# EAGLE schematic u prog with esp12 (EAGLE 9.6.1)
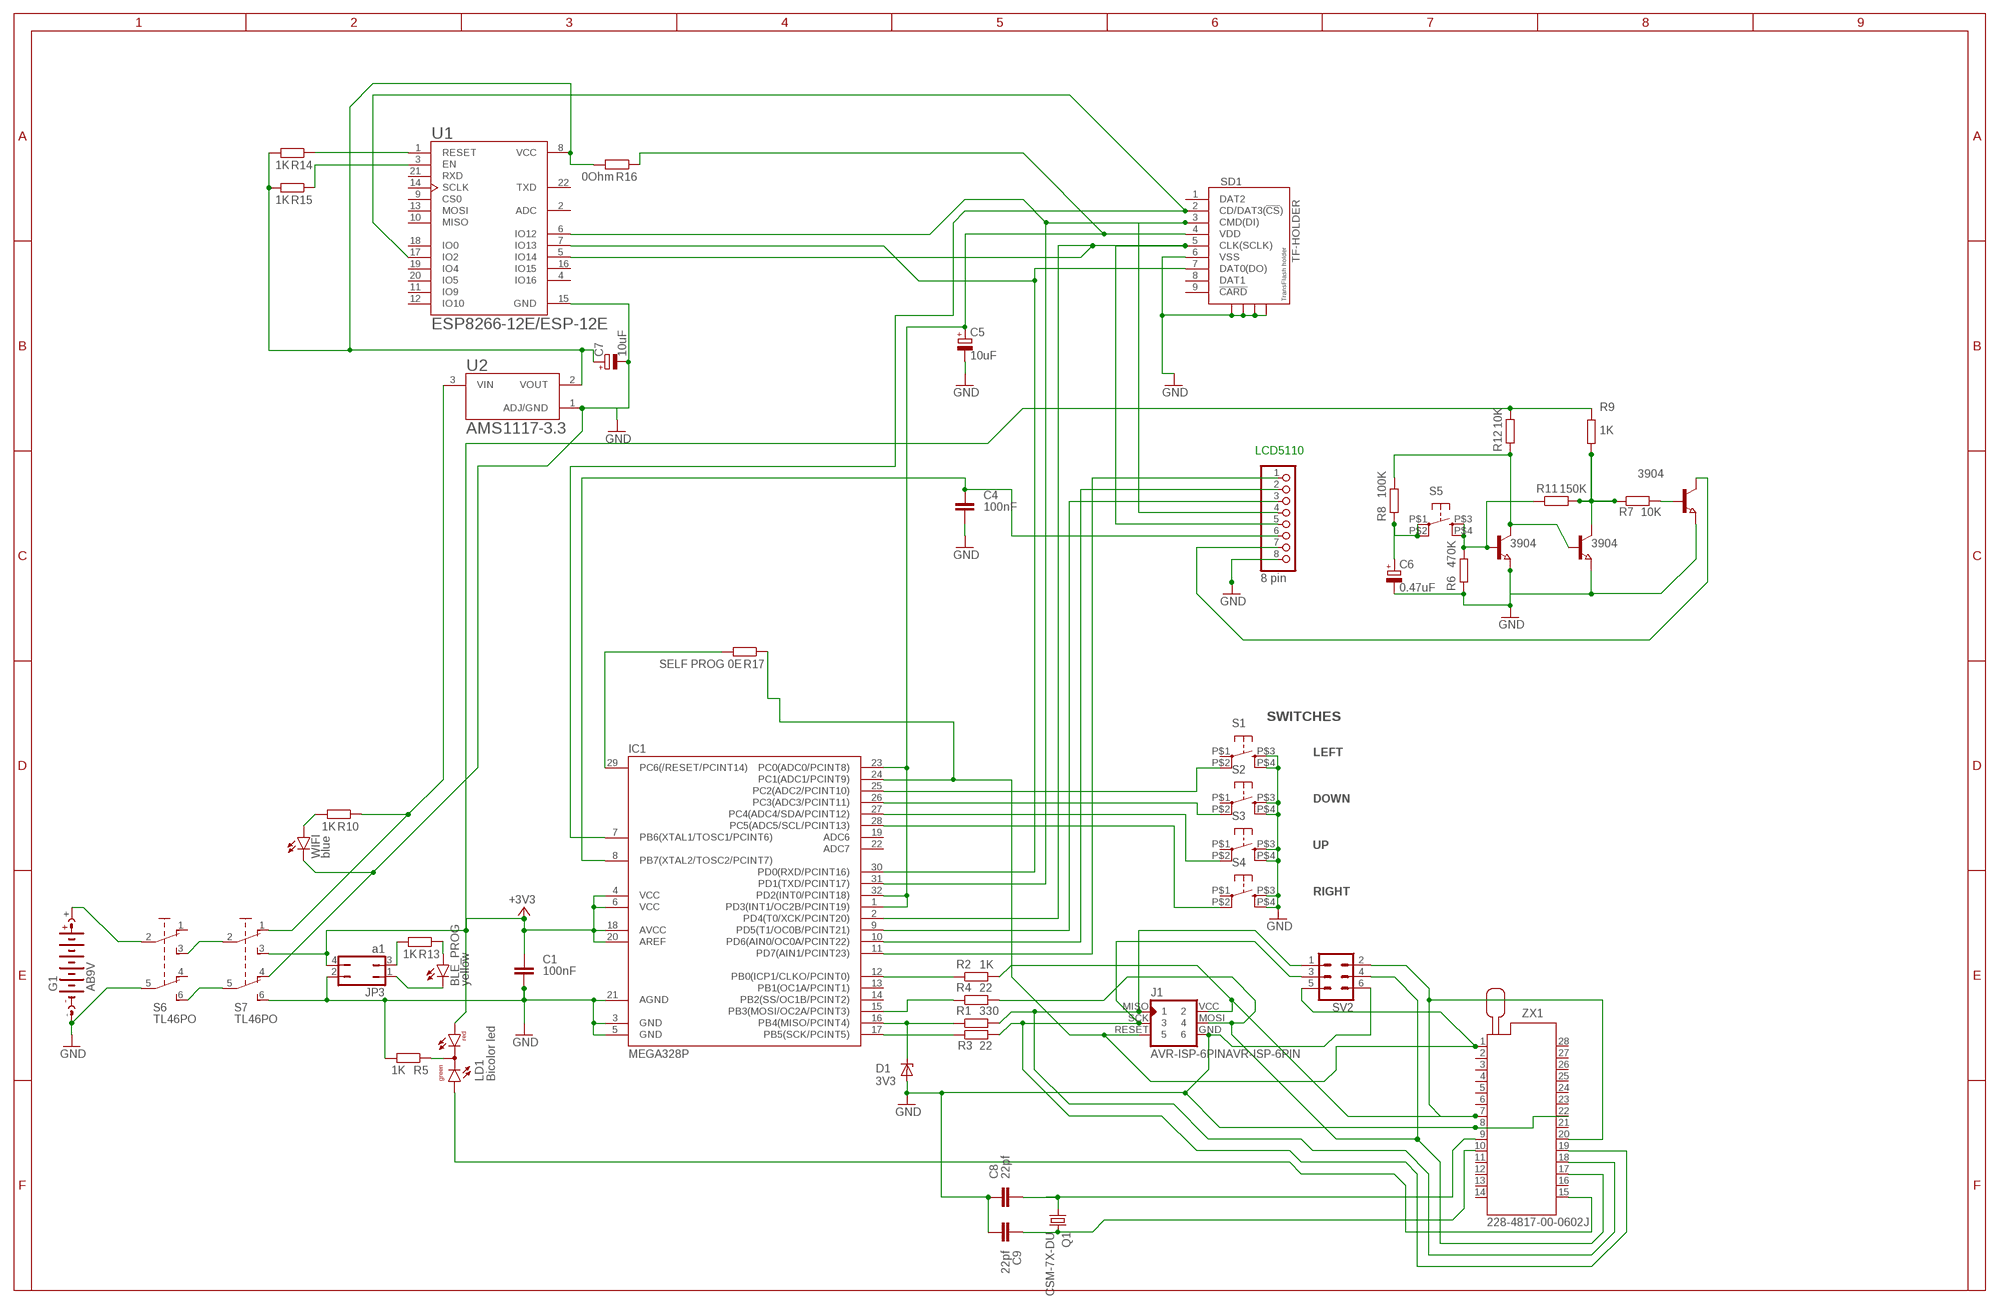
[diagram p0: schematic, sheet 1]

## Parts
BLE_PROG  yellow  LED5MM  [LED5MM]
C1  100nF  C-EUC0805  [C0805]
C4  100nF  C-EUC0805  [C0805]
C5  10uF  CPOL-EUC/6032-28R  [C/6032-28R]
C6  0.47uF  CPOL-EUC/6032-28R  [C/6032-28R]
C7  10uF  CPOL-EUC/6032-28R  [C/6032-28R]
C8  22pf  C-EUC0805  [C0805]
C9  22pf  C-EUC0805  [C0805]
D1  3V3  ZENER-DIODESOD80C  [SOD80C]
G1  AB9V  [AB9V]
IC1  MEGA328P  MEGA48/88/168-AU  [TQFP32-08]
J1  AVR-ISP-6PINAVR-ISP-6PIN  [AVR-ISP-6PIN]
JP1  8 pin  PINHD-1X8  [1X08]
JP3  a1  JP2Q  [JP2Q]
LD1  Bicolor led  DUOLED-RG-C  [DUOLED-C-5MM]
Q1  CSM-7X-DU  [CSM-7X-DU]
Q2  3904  NPN-TRANSISTOR_SOT23  [SOT23]
Q3  3904  NPN-TRANSISTOR_SOT23  [SOT23]
Q4  3904  NPN-TRANSISTOR_SOT23  [SOT23]
R1  330  R-EU_R0805  [R0805]
R2  1K  R-EU_R0805  [R0805]
R3  22  R-EU_R0805  [R0805]
R4  22  R-EU_R0805  [R0805]
R5  1K  R-EU_R0805  [R0805]
R6  470K  R-EU_R0805  [R0805]
R7  10K  R-EU_R0805  [R0805]
R8  100K  R-EU_R0805  [R0805]
R9  1K  R-EU_R0805  [R0805]
R10  1K  R-EU_R0805  [R0805]
R11  150K  R-EU_R0805  [R0805]
R12  10K  R-EU_R0805  [R0805]
R13  1K  R-EU_R0805  [R0805]
R14  1K  R-EU_R0805  [R0805]
R15  1K  R-EU_R0805  [R0805]
R16  0Ohm  R-EU_R0805  [R0805]
R17  SELF PROG 0E  R-EU_R0805  [R0805]
S1  10-XX-SMD  [B3F-10XX-SMD]
S2  10-XX-SMD  [B3F-10XX-SMD]
S3  10-XX-SMD  [B3F-10XX-SMD]
S4  10-XX-SMD  [B3F-10XX-SMD]
S5  10-XX-SMD  [B3F-10XX-SMD]
S6  TL46PO  [TL4XPO]
S7  TL46PO  [TL4XPO]
SD1  TF-HOLDER  [TF-PULL]
SV2  MA03-2  [MA03-2]
U1  ESP8266-12E/ESP-12E  [XCVR_ESP8266-12E/ESP-12E]
U2  AMS1117-3.3  [SOT229P700X180-4N]
WIFI  blue  LED5MM  [LED5MM]
ZX1  228-4817-00-0602J  [228-4817-00-0602J]

## Nets
+3V3: C1.1 IC1.4(VCC) IC1.6(VCC) IC1.18(AVCC) IC1.20(AREF) JP3.4 LD1.AR R9.1 R12.2 S7.3(S)
GND: C1.2 C4.2 C5.- C6.- C7.- C8.1 C9.2 D1.A G1.- IC1.3(GND) IC1.5(GND) IC1.21(AGND) J1.GND JP1.8 JP3.2 Q2.2(E) Q3.2(E) Q4.2(E) R5.2 R6.1 S1.P$3(S) S1.P$4(S1) S2.P$3(S) S2.P$4(S1) S3.P$3(S) S3.P$4(S1) S4.P$3(S) S4.P$4(S1) S6.5(P1) S7.4(O1) S7.6(S1) SD1.6(VSS) SD1.S1 SD1.S2 SD1.S3 SD1.S4 SV2.6 U1.15(GND) U2.1(ADJ/GND) WIFI.K(C) ZX1.8 ZX1.22
LCD-VCC: C4.1 IC1.8(PB7(XTAL2/TOSC2/PCINT7)) JP1.6
MOSI: IC1.15(PB3(MOSI/OC2A/PCINT3)) R4.1
N$1: IC1.17(PB5(SCK/PCINT5)) R3.1
N$2: IC1.12(PB0(ICP1/CLKO/PCINT0)) R2.1
N$3: D1.C IC1.16(PB4(MISO/PCINT4)) R1.1
N$4: IC1.9(PD5(T1/OC0B/PCINT21)) JP1.3
N$5: J1.MISO R1.2 SV2.1 ZX1.18
N$6: J1.SCK R3.2 SV2.3 ZX1.19
N$7: LD1.C R5.1
N$8: G1.+ S6.2(P)
N$9: IC1.30(PD0(RXD/PCINT16)) SD1.7(DAT0(DO)) U1.7(IO13)
N$10: C8.2 Q1.1 ZX1.9
N$11: IC1.11(PD7(AIN1/PCINT23)) JP1.1
N$12: IC1.10(PD6(AIN0/OC0A/PCINT22)) JP1.2
N$13: IC1.31(PD1(TXD/PCINT17)) JP1.4 SD1.3(CMD(DI)) U1.6(IO12)
N$14: C9.1 Q1.2 ZX1.10
N$15: Q2.3(C) Q3.1(B) R8.2 R12.1
N$16: Q3.3(C) R7.1 R9.2 R11.2
N$17: IC1.29(PC6(/RESET/PCINT14)) R17.2
N$18: J1.VCC R2.2 SV2.2 ZX1.7 ZX1.20
N$19: Q2.1(B) R6.2 R11.1 S5.P$3(S) S5.P$4(S1)
N$21: J1.MOSI R4.2 SV2.4 ZX1.17
N$22: IC1.28(PC5(ADC5/SCL/PCINT13)) S4.P$2(P1)
N$23: IC1.27(PC4(ADC4/SDA/PCINT12)) S3.P$2(P1)
N$24: IC1.26(PC3(ADC3/PCINT11)) S2.P$2(P1)
N$25: IC1.25(PC2(ADC2/PCINT10)) S1.P$2(P1)
N$26: LD1.AX(AG) ZX1.15
N$27: C6.+ R8.1 S5.P$1(P) S5.P$2(P1)
N$28: Q4.1(B) R7.2
N$30: JP1.7 Q4.3(C)
N$31: IC1.7(PB6(XTAL1/TOSC1/PCINT6)) SD1.2(CD/DAT3(!CS!)) U1.17(IO2)
N$32: BLE_PROG.A R13.1
N$33: S6.6(S1) S7.5(P1)
N$34: S6.3(S) S7.2(P)
N$35: R10.2 WIFI.A
N$36: R10.1 S7.1(O) U2.3(VIN)
N$37: BLE_PROG.K(C) JP3.1
N$38: JP3.3 R13.2
N$39: R14.1 U1.1(RESET)
N$40: R15.1 U1.3(EN)
N$41: C7.+ R14.2 R15.2 R16.2 U1.8(VCC) U2.2(VOUT)
RST: IC1.24(PC1(ADC1/PCINT9)) J1.RESET R17.1 SV2.5 ZX1.1
SCK2: IC1.2(PD4(T0/XCK/PCINT20)) JP1.5 SD1.5(CLK(SCLK)) U1.5(IO14)
SD-VCC: C5.+ IC1.1(PD3(INT1/OC2B/PCINT19)) IC1.23(PC0(ADC0/PCINT8)) IC1.32(PD2(INT0/PCINT18)) R16.1 SD1.4(VDD)
Unconnected: IC1.13(PB1(OC1A/PCINT1)) IC1.14(PB2(SS/OC1B/PCINT2)) IC1.19(ADC6) IC1.22(ADC7) S1.P$1(P) S2.P$1(P) S3.P$1(P) S4.P$1(P) S6.1(O) S6.4(O1) SD1.1(DAT2) SD1.8(DAT1) SD1.9(!CARD) U1.2(ADC) U1.4(IO16) U1.9(CS0) U1.10(MISO) U1.11(IO9) U1.12(IO10) U1.13(MOSI) U1.14(SCLK) U1.16(IO15) U1.18(IO0) U1.19(IO4) U1.20(IO5) U1.21(RXD) U1.22(TXD) ZX1.2 ZX1.3 ZX1.4 ZX1.5 ZX1.6 ZX1.11 ZX1.12 ZX1.13 ZX1.14 ZX1.16 ZX1.21 ZX1.23 ZX1.24 ZX1.25 ZX1.26 ZX1.27 ZX1.28

## Notes on the sheet
- LCD5110
- SWITCHES
- LEFT
- DOWN
- UP
- RIGHT

## Library data of the parts
BLE_PROG WIFI = led:LED: LED OSRAM: - CHIPLED LG R971, LG N971, LY N971, LG Q971, LY Q971, LO R971, LY R971 LH N974, LH R974 LS Q976, LO Q976, LY Q976 LO Q996 - Hyper CHIPLED LW Q18S LB Q993, LB Q99A, LB R99A - SideLED LS A670, LO A670, LY A670, LG A670, LP A670 LB A673, LV A673, LT A673, LW A673 LH A674 LY A675 LS A676, LA A676, LO A676, LY A676, LW A676 LS A679, LY A679, LG A679 - Hyper Micro SIDELED® LS Y876, LA Y876, LO Y876, LY Y876 LT Y87S - SmartLED LW L88C, LW L88S LB L89C, LB L89S, LG L890 LS L89K, LO L89K, LY L89K LS L896, LA L896, LO L896, LY L896 - TOPLED LS T670, LO T670, LY T670, LG T670, LP T670 LSG T670, LSP T670, LSY T670, LOP T670, LYG T670 LG T671, LOG T671, LSG T671 LB T673, LV T673, LT T673, LW T673 LH T674 LS T676, LA T676, LO T676, LY T676, LB T676, LH T676, LSB T676, LW T676 LB T67C, LV T67C, LT T67C, LS T67K, LO T67K, LY T67K, LW E67C LS E67B, LA E67B, LO E67B, LY E67B, LB E67C, LV E67C, LT E67C LW T67C LS T679, LY T679, LG T679 LS T770, LO T770, LY T770, LG T770, LP T770 LB T773, LV T773, LT T773, LW T773 LH T774 LS E675, LA E675, LY E675, LS T675 LS T776, LA T776, LO T776, LY T776, LB T776 LHGB T686 LT T68C, LB T68C - Hyper Mini TOPLED® LB M676 - Mini TOPLED Santana® LG M470 LS M47K, LO M47K, LY M47K Source: http://www.osram.convergy.de LUXEON: - LUMILED® LXK2-PW12-R00, LXK2-PW12-S00, LXK2-PW14-U00, LXK2-PW14-V00 LXK2-PM12-R00, LXK2-PM12-S00, LXK2-PM14-U00 LXK2-PE12-Q00, LXK2-PE12-R00, LXK2-PE12-S00, LXK2-PE14-T00, LXK2-PE14-U00 LXK2-PB12-K00, LXK2-PB12-L00, LXK2-PB12-M00, LXK2-PB14-N00, LXK2-PB14-P00, LXK2-PB14-Q00 LXK2-PR12-L00, LXK2-PR12-M00, LXK2-PR14-Q00, LXK2-PR14-R00 LXK2-PD12-Q00, LXK2-PD12-R00, LXK2-PD12-S00 LXK2-PH12-R00, LXK2-PH12-S00 LXK2-PL12-P00, LXK2-PL12-Q00, LXK2-PL12-R00 Source: www.luxeon.com KINGBRIGHT: KA-3528ASYC Source: www.kingbright.com
C1 C4 C8 C9 = rcl:C-EU: CAPACITOR, European symbol
C5-C7 = rcl:CPOL-EU: POLARIZED CAPACITOR, European symbol
D1 = diode:ZENER-DIODE: Z-Diode
G1 = battery:AB9V: 9-V BATTERY CLIP
IC1 = avr-6:MEGA48/88/168
J1 = avr-isp:AVR-ISP-6PIN: AVR ISP 6pin 3x2 pin header
JP1 = pinhead:PINHD-1X8: PIN HEADER
JP3 = jumper:JP2Q: JUMPER
LD1 = led:DUOLED-RG-C: DUO LED 2 colors (red/green), 5 mm, round, common Cathode www.ligitek.com or other producers.
Q1 = crystal:CSM-7X-DU: SMD CRYSTAL Source: www.ecsxtal.com .. Crystal 3.6864MHz CSM_7X_DU.PDF; OC_FARNELL: unknown; OC_NEWARK: unknown
Q2-Q4 = semicon-smd-ipc:NPN-TRANSISTOR_: NPN TRANSISTOR
R1-R17 = rcl:R-EU_: RESISTOR, European symbol; SPICEPREFIX: R
S1-S5 = switch-omron:10-XX-SMD
S6 S7 = switch:TL46PO: TINY SWITCH ON - ON Source: http://www2.produktinfo.conrad.com/datenblaetter/700000-724999/705152-da-01-de-Subminiaturschalter_TL_36YO.pdf
SD1 = sd-mmc:TF-HOLDER: TF / Micro SD socket is PUSH-PUSH type, the card can be pushed into and auto locked and pushed out by simply press the card. Surface Mounting type.
SV2 = con-lstb:MA03-2: PIN HEADER; OC_FARNELL: unknown; OC_NEWARK: unknown
U1 = ESP8266-12E_ESP-12E:ESP8266-12E/ESP-12E: ESP-12E WiFi Module Check availability <https://pricing.snapeda.com/parts/ESP8266-12E/ESP-12E/AI-Thinker/view-part?ref=eda>; AVAILABILITY: Not in stock; DESCRIPTION: This WiFi module has a 32-bit MCU micro and clock speeds supporting 80 MHz or 160 MHz. Supports the RTOS and integrated Wi-Fi MAC/BB/RF/PA/LNA, and has an on-board antenna.; MF: AI-Thinker; MP: ESP8266-12E/ESP-12E; PACKAGE: None; PRICE: None
U2 = AMS1117-3.3:AMS1117-3.3: Sot223/Pkg 1-Amp 3.3-Volt Low Drop Out Voltage Regulatator Check availability <https://pricing.snapeda.com/parts/AMS1117-3.3/Advanced%20Monolithic%20Systems/view-part?ref=eda>; AVAILABILITY: In Stock; DESCRIPTION: Sot223/Pkg 1-Amp 3.3-Volt Low Drop Out Voltage Regulatator; MF: Advanced Monolithic Systems; MP: AMS1117-3.3; PACKAGE: SOT-223 Seeed Technology; PRICE: None
ZX1 = con-3m:228-?00-0602J: Zero Insertion Force Socked Source: http://www.3M.com/ehpd; MF: 3M; MPN: 228-4817-00-0602J; OC_FARNELL: 1252775; OC_NEWARK: 85K7834